# EAGLE schematic Overall Design Schematic (EAGLE 6.5.0)
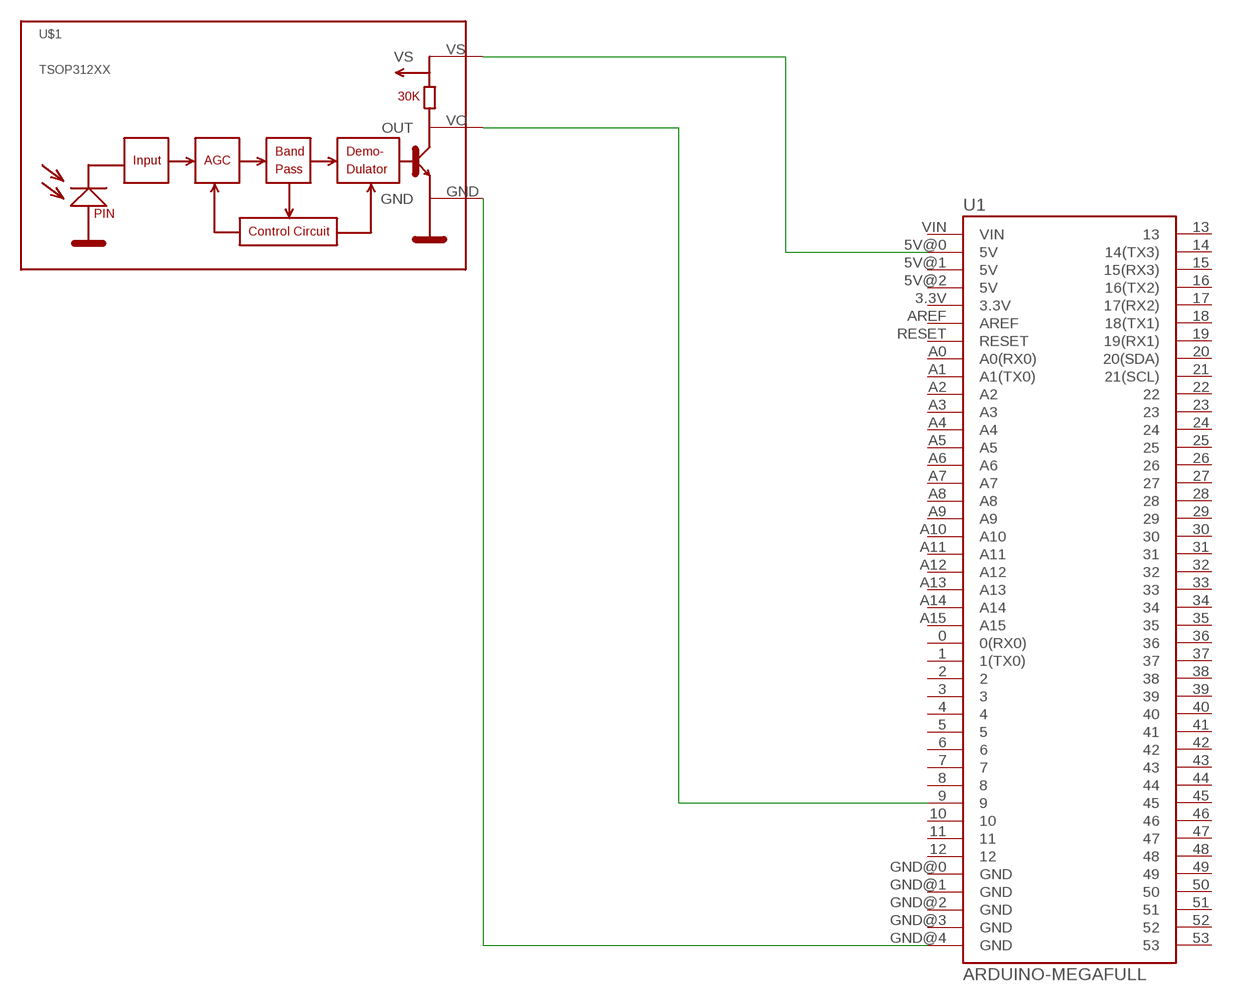
[diagram p0: schematic, sheet 1]

## Parts
U1  ARDUINO-MEGAFULL  [ARDUINO_MEGA]
U$1  TSOP312XX  [TSOP312]

## Nets
GND: U1.GND@4(GND) U$1.GND
N$1: U1.9 U$1.VO(OUT)
N$2: U1.5V@0(5V) U$1.VS
Unconnected: U1.0(0(RX0)) U1.1(1(TX0)) U1.2 U1.3 U1.3.3V U1.4 U1.5 U1.5V@1(5V) U1.5V@2(5V) U1.6 U1.7 U1.8 U1.10 U1.11 U1.12 U1.13 U1.14(14(TX3)) U1.15(15(RX3)) U1.16(16(TX2)) U1.17(17(RX2)) U1.18(18(TX1)) U1.19(19(RX1)) U1.20(20(SDA)) U1.21(21(SCL)) U1.22 U1.23 U1.24 U1.25 U1.26 U1.27 U1.28 U1.29 U1.30 U1.31 U1.32 U1.33 U1.34 U1.35 U1.36 U1.37 U1.38 U1.39 U1.40 U1.41 U1.42 U1.43 U1.44 U1.45 U1.46 U1.47 U1.48 U1.49 U1.50 U1.51 U1.52 U1.53 U1.A0(A0(RX0)) U1.A1(A1(TX0)) U1.A2 U1.A3 U1.A4 U1.A5 U1.A6 U1.A7 U1.A8 U1.A9 U1.A10 U1.A11 U1.A12 U1.A13 U1.A14 U1.A15 U1.AREF U1.GND@0(GND) U1.GND@1(GND) U1.GND@2(GND) U1.GND@3(GND) U1.RESET U1.VIN

## Library data of the parts
U1 = SparkFun-Boards:ARDUINO-MEGA: Arduino Mega board footprint
U$1 = vishay-1:TSOP312XX